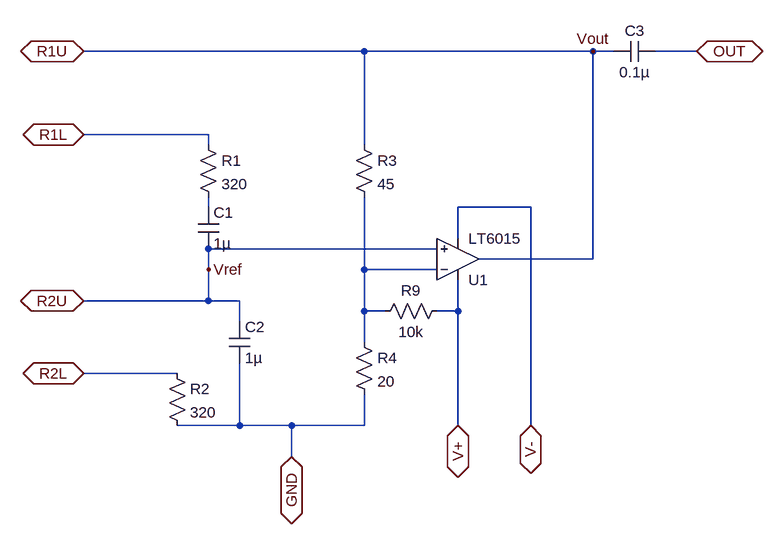
[diagram p0: schematic VCO.asc]
VCO.asc, the LTspice schematic file:
Version 4
SHEET 1 1532 712
WIRE 256 -32 -176 -32
WIRE 608 -32 256 -32
WIRE 640 -32 608 -32
WIRE 768 -32 704 -32
WIRE 16 96 -176 96
WIRE 16 112 16 96
WIRE 256 112 256 -32
WIRE 16 208 16 192
WIRE 512 208 400 208
WIRE 400 256 400 208
WIRE 368 272 16 272
WIRE 608 288 608 -32
WIRE 608 288 432 288
WIRE 16 304 16 272
WIRE 256 304 256 192
WIRE 368 304 256 304
WIRE 16 352 16 304
WIRE 16 352 -176 352
WIRE 64 352 16 352
WIRE 256 368 256 304
WIRE 288 368 256 368
WIRE 400 368 400 320
WIRE 400 368 368 368
WIRE 64 384 64 352
WIRE 256 416 256 368
WIRE -32 464 -176 464
WIRE 64 544 64 448
WIRE 64 544 -32 544
WIRE 144 544 64 544
WIRE 256 544 256 496
WIRE 256 544 144 544
WIRE 400 544 400 368
WIRE 512 544 512 208
WIRE 144 592 144 544
FLAG 768 -32 OUT
IOPIN 768 -32 BiDir
FLAG 608 -32 Vout
FLAG 16 304 Vref
FLAG 144 592 GND
IOPIN 144 592 BiDir
FLAG 400 544 V+
IOPIN 400 544 BiDir
FLAG 512 544 V-
IOPIN 512 544 BiDir
FLAG -176 -32 R1U
IOPIN -176 -32 BiDir
FLAG -176 96 R1L
IOPIN -176 96 BiDir
FLAG -176 352 R2U
IOPIN -176 352 BiDir
FLAG -176 464 R2L
IOPIN -176 464 BiDir
SYMBOL res 0 96 R0
SYMATTR InstName R1
SYMATTR Value 320
SYMATTR SpiceLine tol=1 pwr=0.1
SYMBOL res -48 448 R0
SYMATTR InstName R2
SYMATTR Value 320
SYMATTR SpiceLine tol=1 pwr=0.1
SYMBOL res 240 96 R0
SYMATTR InstName R3
SYMATTR Value 45
SYMATTR SpiceLine tol=1 pwr=0.1
SYMBOL res 240 400 R0
SYMATTR InstName R4
SYMATTR Value 20
SYMATTR SpiceLine tol=1 pwr=0.1
SYMBOL cap 48 384 R0
SYMATTR InstName C2
SYMATTR Value 1µ
SYMBOL cap 0 208 R0
SYMATTR InstName C1
SYMATTR Value 1µ
SYMBOL cap 704 -48 R90
WINDOW 0 0 32 VBottom 2
WINDOW 3 32 32 VTop 2
SYMATTR InstName C3
SYMATTR Value 0.1µ
SYMATTR SpiceLine V=6.3 Irms=25.7m Rser=3.62516 Lser=0
SYMBOL Opamps\\LT6015 400 288 M180
SYMATTR InstName U1
SYMBOL res 384 352 R90
WINDOW 0 0 56 VBottom 2
WINDOW 3 32 56 VTop 2
SYMATTR InstName R9
SYMATTR Value 10k

The netlist it stands for:
* VCO.asc
R1 R1L N001 320 tol=1 pwr=0.1
R2 R2L GND 320 tol=1 pwr=0.1
R3 R1U N002 45 tol=1 pwr=0.1
R4 N002 GND 20 tol=1 pwr=0.1
C2 R2U GND 1µ
C1 N001 R2U 1µ
C3 OUT R1U 0.1µ V=6.3 Irms=25.7m Rser=3.62516 Lser=0
XU1 R2U N002 V+ V- R1U LT6016  ; LT6015, pins In+ In- V+ V- OUT
R9 V+ N002 10k
.lib LTC2.lib
.backanno
.end